# Altium schematic sheet CAN&Humidity_Sensor&HB_LED&IR.SchDoc
size A4; Revision: C.2
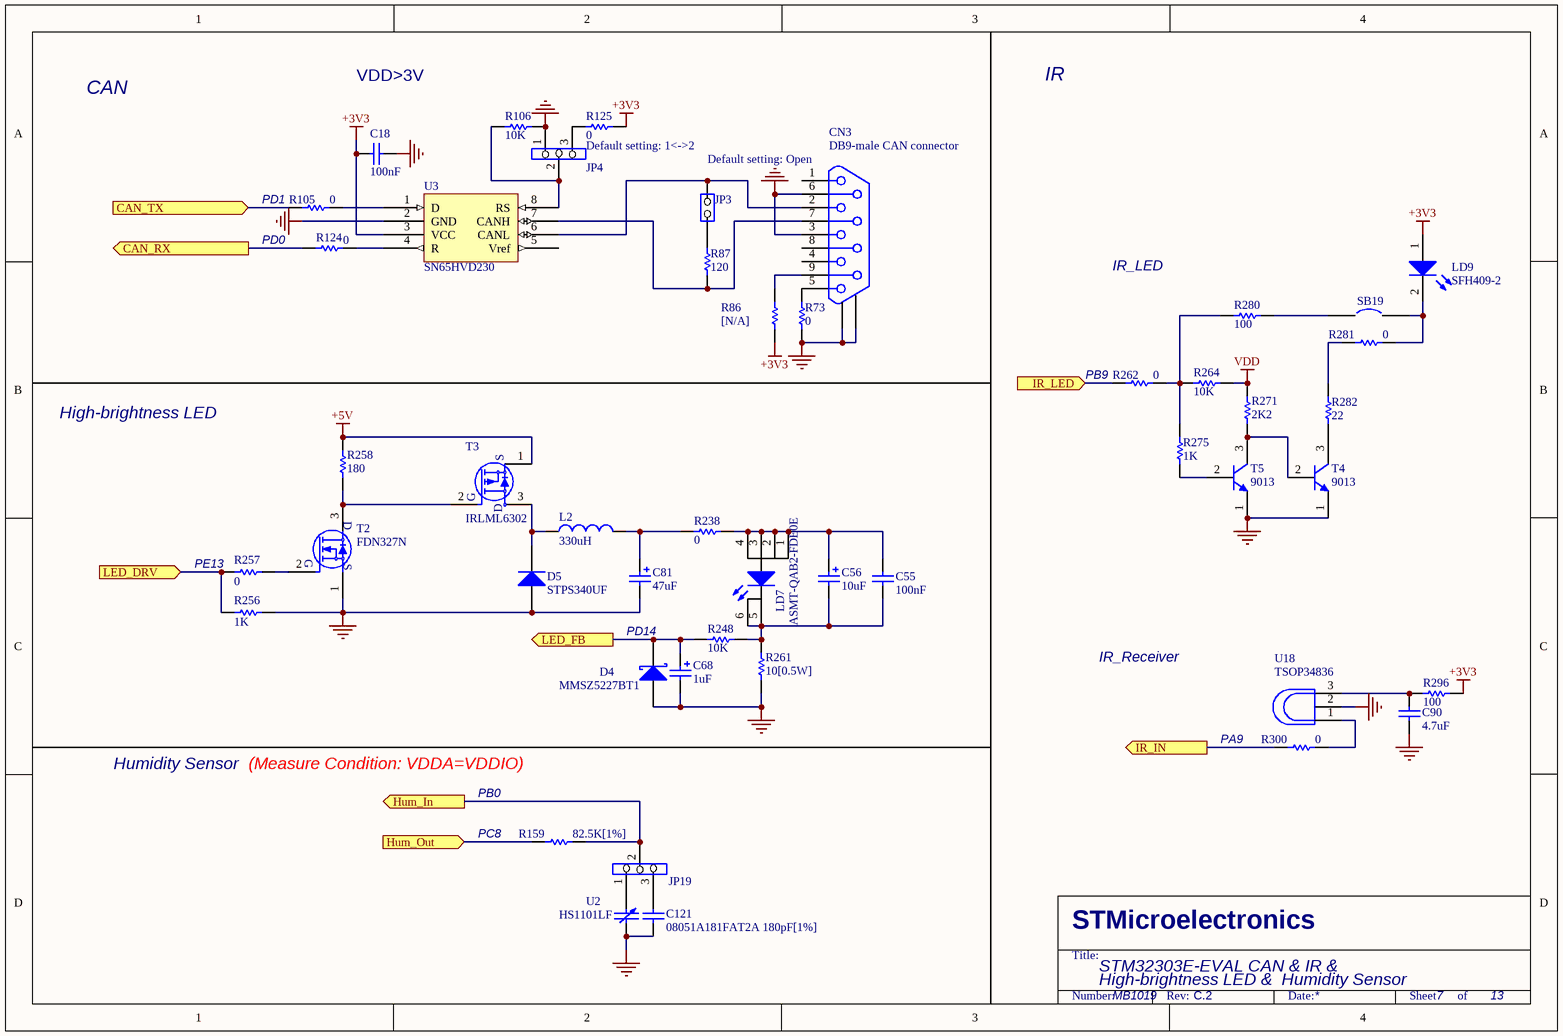
[diagram p0: CAN&Humidity_Sensor&HB_LED&IR.SchDoc]

## Parts
C18  100nF  [0603C]
C55  100nF  [0603C]
C56  10uF  [TAN-A]
C68  1uF  [TAN-A]
C81  47uF  [C200M]
C90  4.7uF  [0603C]
C121  08051A181FAT2A 180pF[1%]  [0805C]
CN3  DB9-male CAN connector  [DB9/M]
D4  MMSZ5227BT1  [SOD-123]
D5  STPS340UF  [SMB]
JP3  (no value)  [SIP2]
JP4  (no value)  [SIP3]
JP19  (no value)  [SIP3]
L2  330uH  [SLF10145]
LD7  ASMT-QAB2-FDE0E  [PLCC4]
LD9  SFH409-2  [D0.1L]
R73  0  [0603R]
R86  [N/A]  [0603R]
R87  120  [0603R]
R105  0  [0603R]
R106  10K  [0603R]
R124  0  [0603R]
R125  0  [0603R]
R159  82.5K[1%]  [0603R]
R238  0  [0603R]
R248  10K  [0603R]
R256  1K  [0603R]
R257  0  [0603R]
R258  180  [0603R]
R261  10[0.5W]  [2010R]
R262  0  [0603R]
R264  10K  [0603R]
R271  2K2  [0603R]
R275  1K  [0603R]
R280  100  [0603R]
R281  0  [0603R]
R282  22  [0603R]
R296  100  [0603R]
R300  0  [0603R]
SB19  (no value)  [JP2_SMD]
T2  FDN327N  [SOT-23]
T3  IRLML6302  [SOT-23]
T4  9013  [SOT-23]
T5  9013  [SOT-23]
U2  HS1101LF  [HS1101LF]
U3  SN65HVD230  [SO8]
U18  TSOP34836  [TSOP348]

## Ports
CAN_RX (out), CAN_TX (in), Hum_In (out), Hum_Out (in), IR_IN (out), IR_LED (in), LED_DRV (in), LED_FB (out)

## Nets
+3V3: C18.2 LD9.1(A) R86.1 R125.2 R296.2 U3.3(VCC)
+5V: R258.1 T3.1(S)
GND: C18.1 C68.2 C81.2 C90.2 C121.1 CN3.0 CN3.3 CN3.6 D4.1(A) D5.1(A) JP4.1 R73.1 R106.2 R256.1 R261.1 T2.1(S) T4.1(E) T5.1(E) U2.2 U3.2(GND) U18.2(GND)
VDD: R264.1 R271.2
CAN_RX: R124.1 ; port CAN_RX
CAN_TX: R105.2 ; port CAN_TX
Hum_In: JP19.2 R159.1 ; port Hum_In
Hum_Out: R159.2 ; port Hum_Out
IR_IN: R300.1 ; port IR_IN
IR_LED: R262.2 ; port IR_LED
LED_DRV: R256.2 R257.1 ; port LED_DRV
LED_FB: C68.1 D4.2(K) R248.1 ; port LED_FB
NetC55_1: C55.1 C56.2 LD7.5(K) LD7.6(K) R248.2 R261.2
NetC55_2: C55.2 C56.1 LD7.1(A) LD7.2(A) LD7.3(A) LD7.4(A) R238.2
NetC81_1: C81.1 L2.2 R238.1
NetC90_1: C90.1 R296.1 U18.3(Vs)
NetC121_2: C121.2 JP19.3
NetCN3_2: CN3.2 JP3.2(NO) U3.6(CANL)
NetCN3_5: CN3.5 R73.2
NetCN3_7: CN3.7 R87.1 U3.7(CANH)
NetCN3_9: CN3.9 R86.2
NetD5_2: D5.2(K) L2.1 T3.3(D)
NetJP3_1: JP3.1(COMMON) R87.2
NetJP4_2: JP4.2 R106.1 U3.8(RS)
NetJP4_3: JP4.3 R125.1
NetJP19_1: JP19.1 U2.1
NetLD9_2: LD9.2(K) R281.2 SB19.2
NetR105_1: R105.1 U3.1(D)
NetR124_2: R124.2 U3.4(R)
NetR257_2: R257.2 T2.2(G)
NetR258_2: R258.2 T2.3(D) T3.2(G)
NetR262_1: R262.1 R264.2 R275.1 R280.2
NetR271_1: R271.1 T4.2(B) T5.3(C)
NetR275_2: R275.2 T5.2(B)
NetR280_1: R280.1 SB19.1
NetR281_1: R281.1 R282.2
NetR282_1: R282.1 T4.3(C)
NetR300_2: R300.2 U18.1(OUT)

Not connected (* = marked no-connect by the designer): CN3 1 4 8; U3 5(Vref)

## Notes on the sheet
- CAN
- VDD>3V
- IR
- Default setting: 1<->2
- (near CN3) Default setting: Open
- (near R105) PD1
- PD0
- IR_LED
- (near R262) PB9
- High-brightness LED
- (near R257) PE13
- PD14
- IR_Receiver
- Humidity Sensor
- (Measure Condition: VDDA=VDDIO)
- PA9
- PB0
- (near R159) PC8
- High-brightness LED &  Humidity Sensor
- STM32303E-EVAL CAN & IR &
- MB1019
- 7
- 13
- STMicroelectronics
- Title:
- Number:
- Rev:
- Date:
- Sheet       of

## Library data of the parts
C18 = CAP: Capacitor; Published: 8-Jun-2000; Revision: July-2002: Re-released for DXP Platform.; Publisher: Altium Limited; Value: 100nF
C55 C90 C121 = Cap: Capacitor; Value: 10nF; Published: 8-Jun-2000; Revision: July-2002: Re-released for DXP Platform.; Publisher: Altium Limited
C56 = Cap Pol1: Polarized Capacitor (Radial); Published: 8-Jun-2000; Revision: July-2002: Re-released for DXP Platform.; Publisher: Altium Limited; Value: 10uF
C68 C81 = Cap Pol1: Polarized Capacitor (Radial); Value: 10uF; Published: 8-Jun-2000; Revision: July-2002: Re-released for DXP Platform.; Publisher: Altium Limited
CN3 = DB9
D4 = D Schottky: Schottky Diode; Code - JEDEC: DO-214-AA; Published: 8-Jun-2000; Revision: July-2002: Re-released for DXP Platform.; Publisher: Altium Limited
D5 = STPS340: Default Diode; Code - JEDEC: DO-214-AB; Published: 8-Jun-2000; Revision: July-2002: Re-released for DXP Platform.; Publisher: Altium Limited
JP3 = JP2
JP4 JP19 = Jumper3
L2 = SLF10145T-331MR54-PF: Inductor; Value: 100uH; Published: 8-Jun-2000; Revision: July-2002: Re-released for DXP Platform.; Publisher: Altium Limited
LD7 = HB_LED: High brightness LED; Published: 8-Jun-2000; Revision: July-2002: Re-released for DXP Platform.; Publisher: Altium Limited
LD9 = LED2: Typical RED, GREEN, YELLOW, AMBER GaAs LED; Published: 8-Jun-2000; Revision: July-2002: Re-released for DXP Platform.; Publisher: Altium Limited
R73 R86 R87 R105 R106 R125 R238 R248 R262 = res1: Resistor; Value: 1K; Published: 8-Jun-2000; Revision: July-2002: Re-released for DXP Platform.; Publisher: Altium Limited
R124 R159 R257 R258 R261 R264 R271 R280-R282 R296 R300 = Res1: Resistor; Value: 1K; Published: 8-Jun-2000; Revision: July-2002: Re-released for DXP Platform.; Publisher: Altium Limited
R256 R275 = Res1: Resistor; Published: 8-Jun-2000; Revision: July-2002: Re-released for DXP Platform.; Publisher: Altium Limited; Value: 1K
SB19 = Circuit Breaker: Published: 24-Mar-1999; Revision: July-2002: Re-released for DXP Platform.; Publisher: Altium Limited
T2 = 2N7000
T4 T5 = NPN: NPN Bipolar Transistor; Code - JEDEC: TO-226-AA; Published: 8-Jun-2000; Revision: July-2002: Re-released for DXP Platform.; Publisher: Altium Limited
U3 = SN65HVD230D
U18 = TSOP34838